# EAGLE design UPS-MAF-APU (EAGLE 9.3.0)
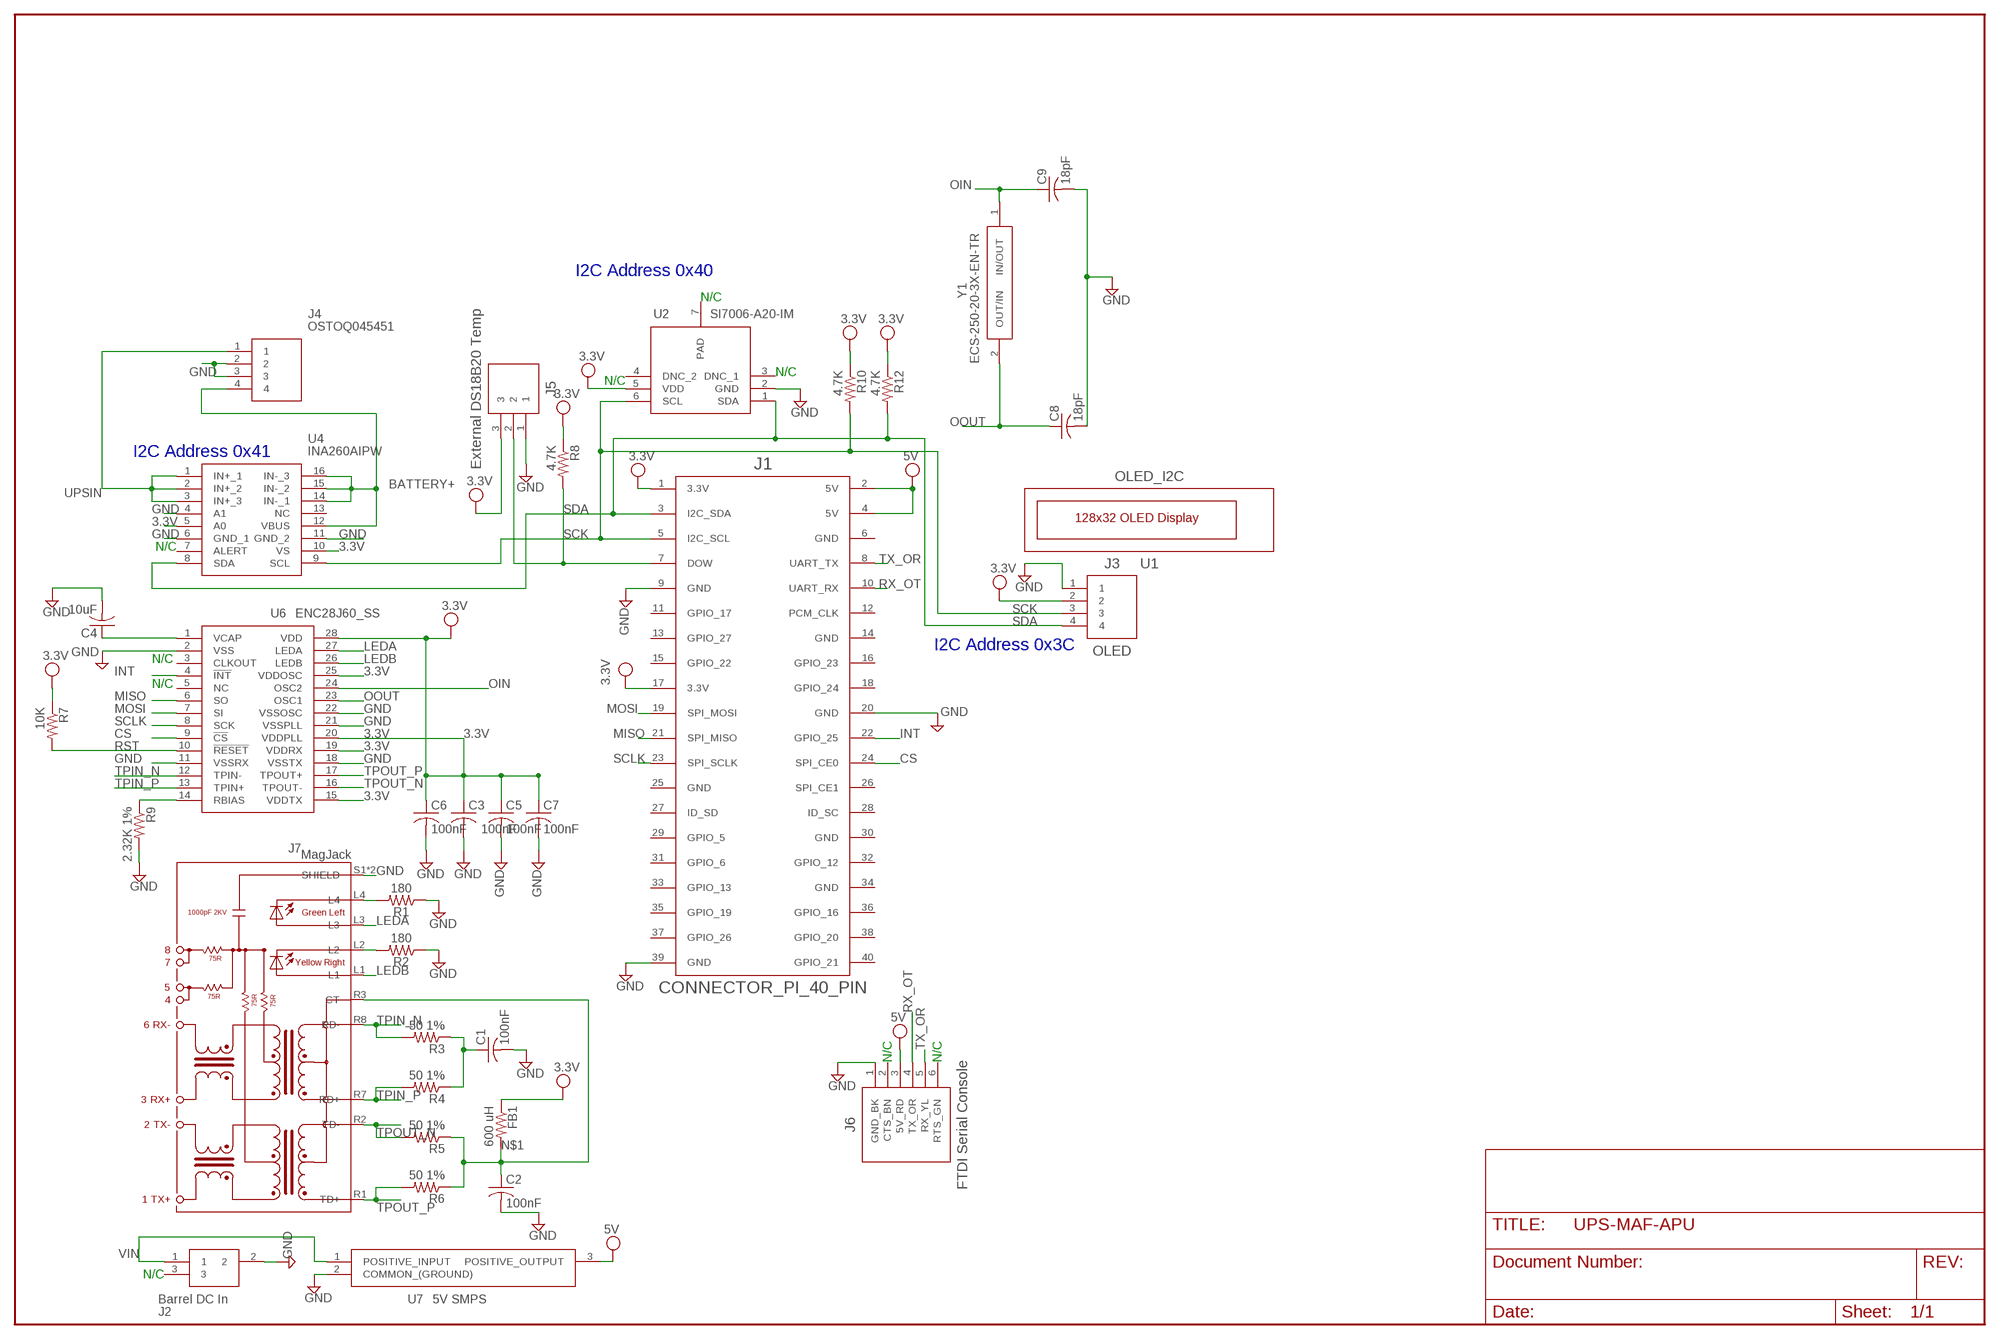
[diagram p0: schematic, sheet 1]

## Parts
C1  100nF  C-USC0603  [C0603]
C2  100nF  C-USC0603  [C0603]
C3  100nF  C-USC0603  [C0603]
C4  10uF  C-USC0805  [C0805]
C5  100nF  C-USC0603  [C0603]
C6  100nF  C-USC0603  [C0603]
C7  100nF  C-USC0603  [C0603]
C8  18pF  C-USC0603  [C0603]
C9  18pF  C-USC0603  [C0603]
FB1  600 uH  R-US_R0805  [R0805]
J1  CONNECTOR_PI_40_PIN  [2X20]
J2  Barrel DC In  PJ-102AH  [PJ-102AH]
J3  OLED  CONNECTOR_4  [ESQ-104-XX-X-S]
J4  OSTOQ045451  [OSTOQ045451]
J5  External DS18B20 Temp  CONNECTOR-3  [MOLEX_70553-0002]
J6  FTDI Serial Console  CONNECTOR-6-FTDI  [ESQ-106-XX-X-S]
J7  MagJack  RB1-125BAG1A  [WIZNET_RB1-125BAG1A]
R1  180  180OHM-0603-1/10W-1%  [0603]
R2  180  180OHM-0603-1/10W-1%  [0603]
R3  50 1%  R-US_R0805  [R0805]
R4  50 1%  R-US_R0805  [R0805]
R5  50 1%  R-US_R0805  [R0805]
R6  50 1%  R-US_R0805  [R0805]
R7  10K  R-US_R0805  [R0805]
R8  4.7K  R-US_R0805  [R0805]
R9  2.32K 1%  R-US_R0805  [R0805]
R10  4.7K  R-US_R0805  [R0805]
R12  4.7K  R-US_R0805  [R0805]
U1  OLED_I2C  [OLED-I2C]
U2  SI7006-A20-IM  [SON100P300X300X80-7N]
U4  INA260AIPW  [SOP65P640X120-16N]
U6  ENC28J60_SS  [SOP65P780X200-28N]
U7  5V SMPS  OKI-78SR-5_1.5-W36H-C  [OKI-78SR-HORIZONTAL]
Y1  ECS-250-20-3X-EN-TR  [ECS250203XENTR]

## Nets
3.3V [supply]: C3.1 C5.1 C6.1 C7.1 FB1.1 J1.1(3.3V) J1.17(3.3V) J3.2 J5.3 R7.1 R8.1 R10.1 R12.1 U2.5(VDD) U4.5(A0) U4.10(VS) U6.15(VDDTX) U6.19(VDDRX) U6.20(VDDPLL) U6.25(VDDOSC) U6.28(VDD)
5V: J1.2(5V) J1.4(5V) J6.3(5V_RD) U7.3(POSITIVE_OUTPUT)
BATTERY+ [POWER]: J4.4 U4.12(VBUS) U4.14(IN-_1) U4.15(IN-_2) U4.16(IN-_3)
CS: J1.24(SPI_CE0) U6.9(!CS)
GND: C1.2 C2.2 C3.2 C4.2 C5.2 C6.2 C7.2 C8.2 C9.2 J1.9(GND) J1.20(GND) J1.39(GND) J2.2 J3.1 J4.2 J4.3 J5.1 J6.1(GND_BK) J7.S1(SHIELD) J7.S2(SHIELD) R1.1 R2.1 R9.2 U2.2(GND) U4.4(A1) U4.6(GND_1) U4.11(GND_2) U6.2(VSS) U6.11(VSSRX) U6.18(VSSTX) U6.21(VSSPLL) U6.22(VSSOSC) U7.2(COMMON_(GROUND))
INT: J1.22(GPIO_25) U6.4(!INT)
LEDA: J7.L3 U6.27(LEDA)
LEDB: J7.L1 U6.26(LEDB)
MISO: J1.21(SPI_MISO) U6.6(SO)
MOSI: J1.19(SPI_MOSI) U6.7(SI)
N$1: C2.1 FB1.2 J7.R3(CT) R5.1 R6.1
N$3: C4.1 U6.1(VCAP)
N$4: J1.7(DOW) J5.2 R8.2
N$5: J7.L2 R2.2
N$6: C1.1 R3.1 R4.1
N$7: J7.L4 R1.2
N$9: R9.1 U6.14(RBIAS)
OIN: C9.1 U6.24(OSC2) Y1.1(IN/OUT)
OOUT: C8.1 U6.23(OSC1) Y1.2(OUT/IN)
RST: R7.2 U6.10(!RESET)
RX_OT: J1.10(UART_RX) J6.4(TX_OR)
SCK: J1.5(I2C_SCL) J3.3 R10.2 U2.6(SCL) U4.9(SCL)
SCLK: J1.23(SPI_SCLK) U6.8(SCK)
SDA: J1.3(I2C_SDA) J3.4 R12.2 U2.1(SDA) U4.8(SDA)
TPIN_N [diffp1]: J7.R8(RD-) R3.2 U6.12(TPIN-)
TPIN_P [diffp1]: J7.R7(RD+) R4.2 U6.13(TPIN+)
TPOUT_N [diff pair 2]: J7.R2(TD-) R5.2 U6.16(TPOUT-)
TPOUT_P [diff pair 2]: J7.R1(TD+) R6.2 U6.17(TPOUT+)
TX_OR: J1.8(UART_TX) J6.5(RX_YL)
UPSIN [POWER]: J4.1 U4.1(IN+_1) U4.2(IN+_2) U4.3(IN+_3)
VIN: J2.1 U7.1(POSITIVE_INPUT)
Unconnected: J1.6(GND) J1.11(GPIO_17) J1.12(PCM_CLK) J1.13(GPIO_27) J1.14(GND) J1.15(GPIO_22) J1.16(GPIO_23) J1.18(GPIO_24) J1.25(GND) J1.26(SPI_CE1) J1.27(ID_SD) J1.28(ID_SC) J1.29(GPIO_5) J1.30(GND) J1.31(GPIO_6) J1.32(GPIO_12) J1.33(GPIO_13) J1.34(GND) J1.35(GPIO_19) J1.36(GPIO_16) J1.37(GPIO_26) J1.38(GPIO_20) J1.40(GPIO_21) J2.3 J6.2(CTS_BN) J6.6(RTS_GN) U2.3(DNC_1) U2.4(DNC_2) U4.7(ALERT) U4.13(NC) U6.3(CLKOUT) U6.5(NC)

## Notes on the sheet
- I2C Address 0x40
- N/C
- N/C | N/C
- I2C Address 0x41
- N/C
- I2C Address 0x3C
- N/C
- N/C
- N/C | N/C
- N/C

## Power pins joined to a net without a drawn wire
PAD: U2.7(PAD)

## Library data of the parts
C1-C9 = resistor:C-US: CAPACITOR, American symbol
FB1 R4-R7 R9 = adafruit:R-US_: RESISTOR, American symbol
J1 = APU_ENGR480_UPS_EAGLE_Library:CONNECTOR_PI_40_PIN
J2 = APU_ENGR480_UPS_EAGLE_Library:PJ-102AH: DC POWER JACK Source: Datasheet <http://www.cui.com/product/resource/digikeypdf/pj-102ah.pdf>; DESCRIPTION: DC POWER JACK; HEIGHT: mm; MANUFACTURER_NAME: CUI; MANUFACTURER_PART_NUMBER: PJ-102AH; MOUSER_PART_NUMBER: 490-PJ-102AH; MOUSER_PRICE-STOCK: https://www.mouser.com/Search/Refine.aspx?Keyword=490-PJ-102AH
J3 = APU_ENGR480_UPS_EAGLE_Library:CONNECTOR_4
J4 = APU_ENGR480_UPS_EAGLE_Library:OSTOQ045451: 5.08mm series Close right-angle 4pin Source: Datasheet <http://www.on-shore.com/wp-content/uploads/2015/09/ostoqxx5451.pdf>; DESCRIPTION: 5.08mm series Close right-angle 4pin; HEIGHT: 8.5mm; MANUFACTURER_NAME: On-Shore Technology, Inc; MANUFACTURER_PART_NUMBER: OSTOQ045451
J5 = APU_ENGR480_UPS_EAGLE_Library:CONNECTOR-3
J6 = APU_ENGR480_UPS_EAGLE_Library:CONNECTOR-6-FTDI
J7 = APU_ENGR480_UPS_EAGLE_Library:RB1-125BAG1A: Accessory RJ-45 With Transformer Connector - UDE From SnapEDA; AVAILABILITY: Good; DESCRIPTION: Accessory RJ-45 With Transformer Connector - UDE; MF: WIZnet; MP: RB1-125BAG1A; PACKAGE: None; PRICE: 2.18 USD
R1 R2 = SparkFun-Resistors:180OHM: 180Ω resistor A resistor is a passive two-terminal electrical component that implements electrical resistance as a circuit element. Resistors act to reduce current flow, and, at the same time, act to lower voltage levels within circuits. - Wikipedia; PROD_ID: RES-08788
R3 R8 R10 R12 = adafruit:R-US_: RESISTOR, American symbol; CRCW060350R0FKEA: 50
U1 = APU_ENGR480_UPS_EAGLE_Library:OLED_I2C
U2 = APU_ENGR480_UPS_EAGLE_Library:SI7006-A20-IM: Silicon Labs Si7006-A20-IM Temperature & Humidity Sensor 6-Pin DFN, -40 +125 C Source: Datasheet <https://componentsearchengine.com/Datasheets/2/SI7006-A20-IM.pdf>; DESCRIPTION: Silicon Labs Si7006-A20-IM Temperature & Humidity Sensor 6-Pin DFN, -40 +125 C; HEIGHT: 0.8mm; MANUFACTURER_NAME: Silicon Labs; MANUFACTURER_PART_NUMBER: Si7006-A20-IM; MOUSER_PART_NUMBER: 634-SI7006-A20-IM; MOUSER_PRICE-STOCK: https://www.mouser.com/Search/Refine.aspx?Keyword=634-SI7006-A20-IM; RS_PART_NUMBER: 8652274P; RS_PRICE-STOCK: http://uk.rs-online.com/web/p/products/8652274P
U4 = APU_ENGR480_UPS_EAGLE_Library:INA260AIPW: 36V, Bi-Dir, High Accuracy, Low-/High-Side, I2C Current/Pwr Monitor w/Integrated 2m Shunt Resistor Source: Datasheet <http://www.ti.com/lit/gpn/ina260>; DESCRIPTION: 36V, Bi-Dir, High Accuracy, Low-/High-Side, I2C Current/Pwr Monitor w/Integrated 2m Shunt Resistor; HEIGHT: 1.2mm; MANUFACTURER_NAME: Texas Instruments; MANUFACTURER_PART_NUMBER: INA260AIPW; MOUSER_PART_NUMBER: 595-INA260AIPW; MOUSER_PRICE-STOCK: https://www.mouser.com/Search/Refine.aspx?Keyword=595-INA260AIPW
U6 = APU_ENGR480_UPS_EAGLE_Library:ENC28J60_SS: Ethernet ICs 8 KB RAM MAC&PHY Ethernet Controller Source: Datasheet <http://docs-emea.rs-online.com/webdocs/0cee/0900766b80ceeb3f.pdf>; ALLIED_NUMBER: 70046819; ALLIED_PRICE-STOCK: http://www.alliedelec.com/microchip-technology-inc-enc28j60-ss/70046819/; DESCRIPTION: Ethernet ICs 8 KB RAM MAC&PHY Ethernet Controller; HEIGHT: 2mm; MANUFACTURER_NAME: Microchip; MANUFACTURER_PART_NUMBER: ENC28J60/SS; MOUSER_PART_NUMBER: 579-ENC28J60/SS; MOUSER_PRICE-STOCK: https://www.mouser.com/Search/Refine.aspx?Keyword=579-ENC28J60%2FSS; RS_PART_NUMBER: 6665713P; RS_PRICE-STOCK: http://uk.rs-online.com/web/p/products/6665713P
U7 = APU_ENGR480_UPS_EAGLE_Library:OKI-78SR-5_1.5-W36H-C: Switching Regulator 7-36Vin 5Vo 1.5A Non-Isolated DC-DC Converter, 5V dc Output, 1.5A Source: Datasheet <http://www.mouser.com/ds/2/281/oki-78sr-56393.pdf>; DESCRIPTION: Switching Regulator 7-36Vin 5Vo 1.5A Non-Isolated DC-DC Converter, 5V dc Output, 1.5A; HEIGHT: mm; MANUFACTURER_NAME: Murata Electronics; MANUFACTURER_PART_NUMBER: OKI-78SR-5/1.5-W36H-C; MOUSER_PART_NUMBER: 580-OKI78SR51.5W36HC; MOUSER_PRICE-STOCK: https://www.mouser.com/Search/Refine.aspx?Keyword=580-OKI78SR51.5W36HC; RS_PART_NUMBER: 1736931; RS_PRICE-STOCK: http://uk.rs-online.com/web/p/products/1736931
Y1 = APU_ENGR480_UPS_EAGLE_Library:ECS-250-20-3X-EN-TR: CRYSTAL 25.0000MHZ 20PF SMD Source: Datasheet <http://www.ecsxtal.com/store/pdf/CSM-3X.pdf>; DESCRIPTION: CRYSTAL 25.0000MHZ 20PF SMD; HEIGHT: 2.3mm; MANUFACTURER_NAME: ECS Inc.; MANUFACTURER_PART_NUMBER: ECS-250-20-3X-EN-TR

## Net classes
1 POWER: width 2.54 mm, drill 0.508 mm
2 diffp1: width 0.203 mm, clearance 0.254 mm
3 diff pair 2: width 0.203 mm, clearance 0.254 mm
4 supply: width 0.33 mm

## Board
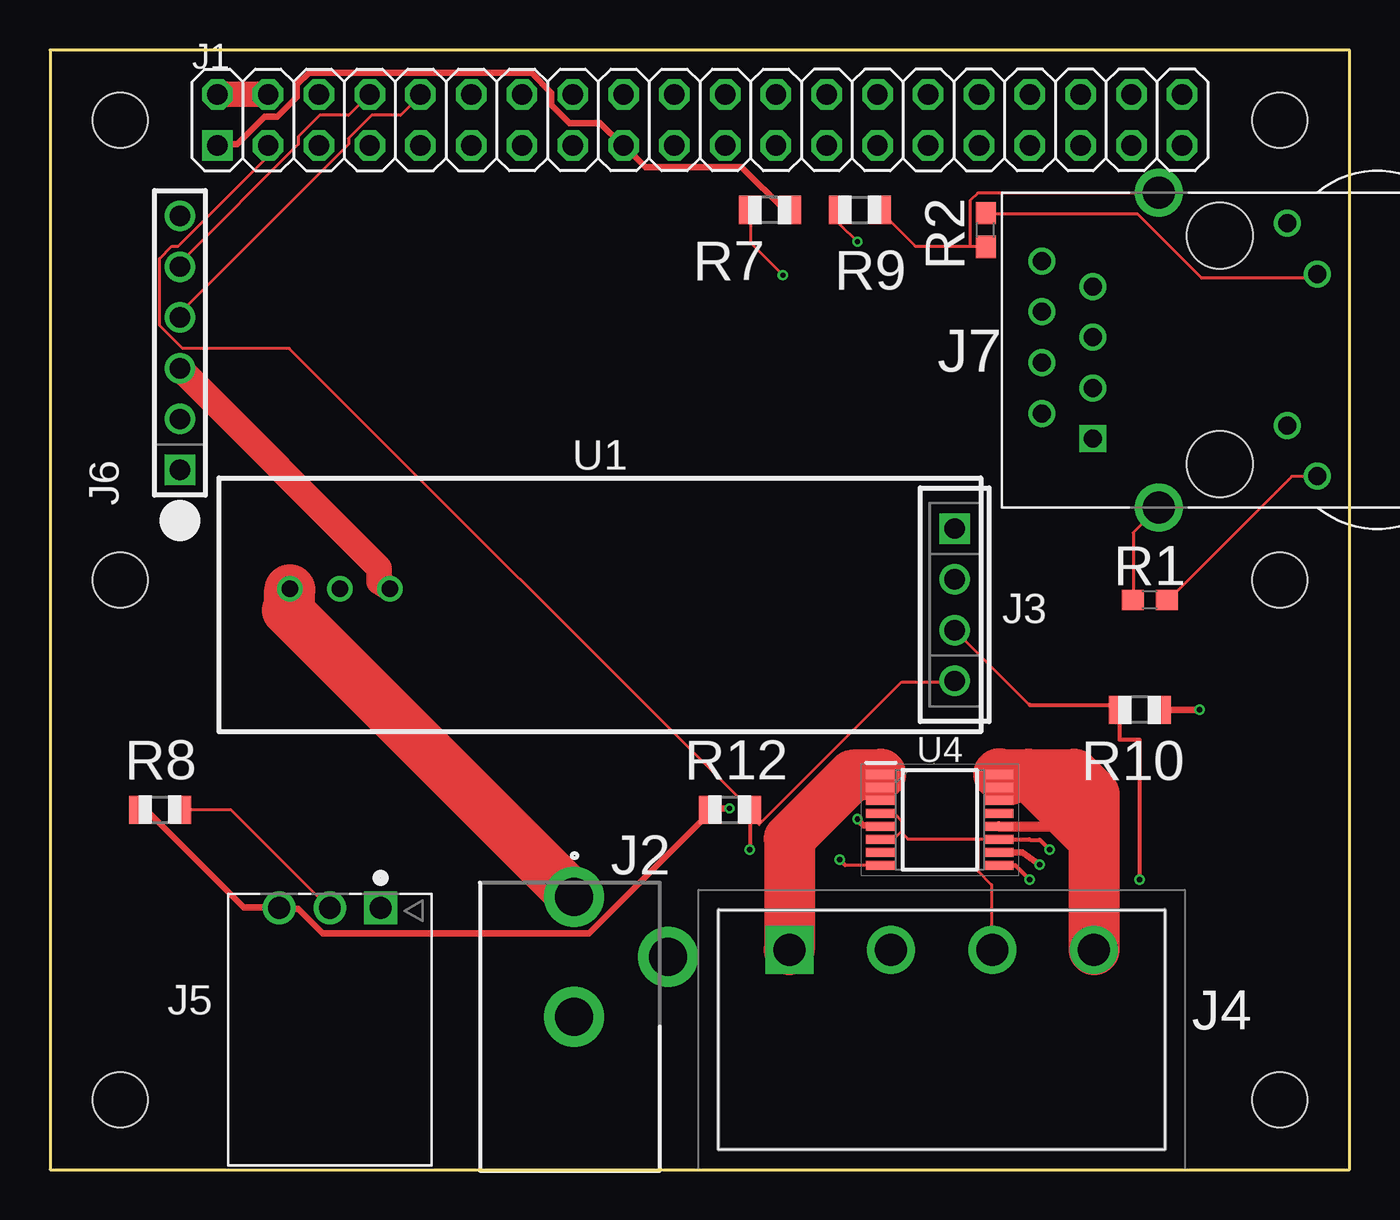
[diagram p1: board, top side]
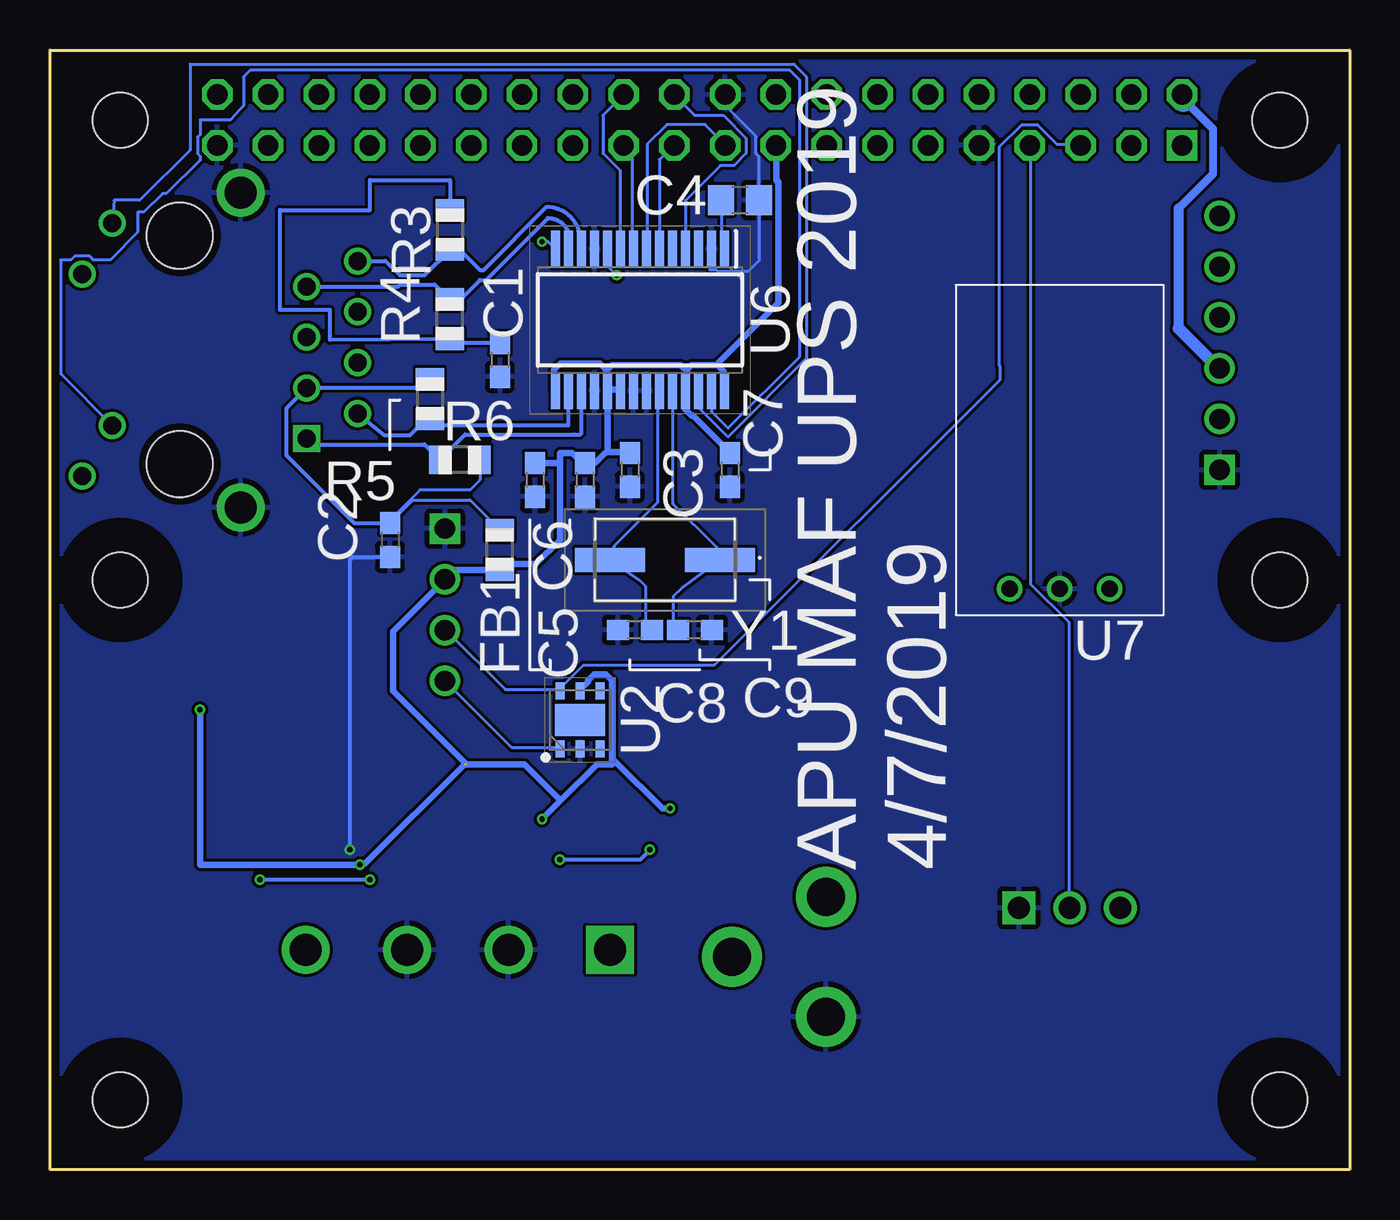
[diagram p2: board, bottom side, seen from below]

Size 65 x 56 mm. Coordinates in mm from the lower left corner, seen from the top.
Outline: 0,0 65,0 65,56 0,56 0,0
Copper layers (1*16): Top 0.035559375mm / dielectric 1.6mm / Bottom 0.035559375mm
Design rules "oshpark-2layer *": minimum track width 6mil, minimum drill 10mil, track to track 6mil, track to pad 6mil, pad to pad 6mil, via to via 6mil, smd to smd 6mil, copper to edge 15mil, drill to drill 6mil, minimum pad ring 5mil, minimum via ring 5mil, stop-mask expansion 2.5mil, vias tented up to drill 20mil, thermal gap 10mil
Holes 2.75 mm at 3.5,3.5 61.5,3.5 61.5,52.5 3.5,52.5 3.5,29.5 61.5,29.5
tKeepout: area 0.4,49.4 to 6.6,55.6; area 0.4,26.4 to 6.6,32.6; area 58.4,49.4 to 64.6,55.6; area 58.4,26.4 to 64.6,32.6; area 58.4,0.4 to 64.6,6.6; area 0.4,0.4 to 6.6,6.6
bKeepout: area 0.4,0.4 to 6.6,6.6; area 58.4,49.4 to 64.6,55.6; area 58.4,0.4 to 64.6,6.6; area 0.4,26.4 to 6.6,32.6; area 58.4,26.4 to 64.6,32.6; area 0.4,49.4 to 6.6,55.6
tRestrict: area 0.4,0.4 to 6.6,6.6; area 0.4,49.4 to 6.6,55.6; area 58.4,49.4 to 64.6,55.6; area 58.4,0.4 to 64.6,6.6; area 58.4,26.4 to 64.6,32.6; area 0.4,26.4 to 6.6,32.6
bRestrict: area 0.4,49.4 to 6.6,55.6; area 0.4,26.4 to 6.6,32.6; area 58.4,49.4 to 64.6,55.6; area 58.4,26.4 to 64.6,32.6; area 0.4,0.4 to 6.6,6.6; area 58.4,0.4 to 64.6,6.6

### Footprints (pad centres in the part's own frame; a part is rotated, then mirrored left to right if it is on the bottom)
C0603 = smd 1.1 x 1: 1 -0.85,0; 2 0.85,0
C0805 = smd 1.3 x 1.5: 1 -0.95,0; 2 0.95,0
R0805 = smd 1.1 x 1.4: 1 -1,0; 2 1,0
2X20 = drill 1.016 square: 1 -24.13,-1.27 | drill 1.016 octagon: 2 -24.13,1.27; 3 -21.59,-1.27; 4 -21.59,1.27; 5 -19.05,-1.27; 6 -19.05,1.27; 7 -16.51,-1.27; 8 -16.51,1.27; 9 -13.97,-1.27; 10 -13.97,1.27; 11 -11.43,-1.27; 12 -11.43,1.27; 13 -8.89,-1.27; 14 -8.89,1.27; 15 -6.35,-1.27; 16 -6.35,1.27; 17 -3.81,-1.27; 18 -3.81,1.27; 19 -1.27,-1.27; 20 -1.27,1.27; 21 1.27,-1.27; 22 1.27,1.27; 23 3.81,-1.27; 24 3.81,1.27; 25 6.35,-1.27; 26 6.35,1.27; 27 8.89,-1.27; 28 8.89,1.27; 29 11.43,-1.27; 30 11.43,1.27; 31 13.97,-1.27; 32 13.97,1.27; 33 16.51,-1.27; 34 16.51,1.27; 35 19.05,-1.27; 36 19.05,1.27; 37 21.59,-1.27; 38 21.59,1.27; 39 24.13,-1.27; 40 24.13,1.27
PJ-102AH = drill 1.9 pad 3: 1 4.3,-3; 2 4.3,3; 3 -0.4,0
ESQ-104-XX-X-S = drill 1.016 pad 1.524 square: 1 -3.81,0 | drill 1.016 pad 1.524: 2 -1.27,0; 3 1.27,0; 4 3.81,0
OSTOQ045451 = drill 1.6 pad 2.4 square: 1 0,0 | drill 1.6 pad 2.4: 2 5.08,0; 3 10.16,0; 4 15.24,0
MOLEX_70553-0002 = drill 1.09 pad 1.64 square: 1 2.54,6.095 | drill 1.09 pad 1.64: 2 0,6.095; 3 -2.54,6.095
ESQ-106-XX-X-S = drill 1.016 pad 1.524 square: 1 0,0 | drill 1.016 pad 1.524: 2 2.54,0; 3 5.08,0; 4 7.62,0; 5 10.16,0; 6 12.7,0
WIZNET_RB1-125BAG1A = drill 0.9: L1 6.325,-3.38; L2 3.784,-4.899; L3 -3.786,-3.379; L4 -6.325,-4.9 | drill 0.9 pad 1.3 square: R1 -4.446,6.349 | drill 0.9 pad 1.3: R2 -3.176,8.889; R3 -1.906,6.349; R4 -0.636,8.889; R5 0.634,6.349; R6 1.904,8.889; R7 3.174,6.349; R8 4.444,8.889 | drill 1.6 pad 2.184: S1 -7.876,3.049; S2 7.874,3.049 | hole 3.3: 5.714,-0.001; -5.716,-0.001
0603 = smd 1.1 x 1: 1 -0.85,0; 2 0.85,0
SON100P300X300X80-7N = smd 0.85 x 0.45: 1 -1.45,1; 2 -1.45,0; 3 -1.45,-1; 4 1.45,-1; 5 1.45,0; 6 1.45,1 | smd 1.6 x 2.5: 7 0,0
SOP65P640X120-16N = smd 1.475 x 0.45: 1 -2.938,2.275; 2 -2.938,1.625; 3 -2.938,0.975; 4 -2.938,0.325; 5 -2.938,-0.325; 6 -2.938,-0.975; 7 -2.938,-1.625; 8 -2.938,-2.275; 9 2.938,-2.275; 10 2.938,-1.625; 11 2.938,-0.975; 12 2.938,-0.325; 13 2.938,0.325; 14 2.938,0.975; 15 2.938,1.625; 16 2.938,2.275
SOP65P780X200-28N = smd 1.8 x 0.45: 1 -3.55,4.225; 2 -3.55,3.575; 3 -3.55,2.925; 4 -3.55,2.275; 5 -3.55,1.625; 6 -3.55,0.975; 7 -3.55,0.325; 8 -3.55,-0.325; 9 -3.55,-0.975; 10 -3.55,-1.625; 11 -3.55,-2.275; 12 -3.55,-2.925; 13 -3.55,-3.575; 14 -3.55,-4.225; 15 3.55,-4.225; 16 3.55,-3.575; 17 3.55,-2.925; 18 3.55,-2.275; 19 3.55,-1.625; 20 3.55,-0.975; 21 3.55,-0.325; 22 3.55,0.325; 23 3.55,0.975; 24 3.55,1.625; 25 3.55,2.275; 26 3.55,2.925; 27 3.55,3.575; 28 3.55,4.225
OKI-78SR-HORIZONTAL = drill 0.835 pad 1.252: 1 2.5,-6.95; 2 0,-6.95; 3 -2.5,-6.95
ECS250203XENTR = smd 3.5 x 1.2: 1 -2.75,0; 2 2.75,0

### Placement (x,y rotation side)
C1  42.5,40.5 270 bottom
C2  48,31.5 270 bottom
C3  36,35 270 bottom
C4  30.5,48.5 0 bottom
C5  40.75,34.5 270 bottom
C6  38.25,34.5 270 bottom
C7  31,35 270 bottom
C8  35.75,27 180 bottom
C9  32.75,27 0 bottom
FB1  42.5,31 90 bottom
J1  32.5,52.5 0 top
J2  30.5,10.65 180 top
J3  45.25,28.25 270 top
J4  36.98,11 0 top
J5  14,7 0 top
J6  6.5,35 90 top
J7  58.5,41 90 top
R1  55,28.5 0 top
R2  46.8,47 90 top
R3  45,47 270 bottom
R4  45,42.55 90 bottom
R5  46,38.55 270 bottom
R6  44.5,35.5 180 bottom
R7  36,48 180 top
R8  5.5,18 0 top
R9  40.5,48 0 top
R10  54.5,23 180 top
R12  34,18 0 top
U1  27.5,28.25 180 top
U2  38.5,22.5 90 bottom
U4  44.5,17.5 0 top
U6  35.5,42.5 270 bottom
U7  14.5,36 0 bottom
Y1  34.25,30.5 180 bottom

### Tracks (layer width: path | path; a pad name or v marks a point on that pad's centre or on a via)
3.3V  (via drill 0.25)  (2 unrouted)
  Top 0.33: R7.1 36.96,48.01 36.73,48.01 34.59,50.14 29.79,50.14 28.73,51.21 J1.17 28.57,51.28 27.51,52.35 25.98,52.35 25.07,53.26 25.07,53.87 24.08,54.86 12.95,54.86 12.34,54.25 12.34,53.65 11.35,52.65 10.74,52.65 9.37,51.28 8.38,51.28 J1.1 | R8.1 4.57,17.98 4.8,17.98 9.68,13.11 11.43,13.11 J5.3 11.58,13.03 12.42,13.03 13.64,11.81 26.98,11.81 33.07,17.91 R12.1 33.07,18.06 v33.98,18.06 | v40.39,17.53 40.69,17.22 41.53,17.22 U4.5 | U4.10 48.62,15.88 v49.5,15.25 | R10.1 v57.5,23
  Bottom 0.33: C7.1 31.01,35.89 32.84,37.72 32.92,37.72 33.22,38.02 33.22,38.94 U6.25 33.15,39.09 33.15,40.01 | 31.62,40.23 31.32,39.93 31.32,39.01 U6.28 | 31.62,40.23 32.92,40.23 33.15,40.01 | 37.11,35.89 36.08,35.89 C3.1 | U6.20 36.5,39.01 37.11,39.01 U6.19 | 37.19,40.01 37.49,40.31 39.47,40.31 39.78,40.01 39.78,39.01 U6.15 | 37.19,40.01 37.19,39.17 U6.19 | 37.11,35.89 37.11,38.79 U6.19 | 33.15,40.01 33.3,40.08 33.45,40.23 36.88,40.23 37.03,40.08 37.19,40.01 | 36.88,20.5 36.88,24.46 37.19,24.77 37.8,24.77 38.1,24.46 38.1,24.38 38.48,24 U2.5 | 36.88,20.5 36.89,20.49 36.89,20.27 37.64,20.27 39.46,18.46 | 44.17,20.27 47.83,23.93 47.83,26.92 45.26,29.49 J3.2 45.11,29.57 44.68,30 FB1.1 | v33.98,18.06 34.37,18.06 36.73,20.42 36.88,20.5 | 39.46,18.46 v40.39,17.53 | 42.44,30.13 FB1.1 | 28.65,51.21 J1.17 28.65,51.05 28.65,49.45 28.57,49.38 28.57,43.36 31.55,40.39 31.62,40.23 | v57.5,23 57.5,15.25 v49.5,15.25 49.38,15.32 49.23,15.32 44.27,20.27 41.27,20.27 39.46,18.46 | 37.11,35.89 37.26,35.81 37.72,35.36 38.18,35.36 C6.1 38.41,35.36 38.9,35.85 39.5,35.85 39.5,35.35 | 41,35.31 C5.1 39.5,35.35 | 39.5,35.35 39.5,31.5 40.73,30.27 42.23,30.27 FB1.1
5V
  Top 0.152: 8.38,53.8 J1.2 | 10.9,53.8 J1.4 | 6.55,40.01 J6.3
  Top 1.27: 10.9,53.8 8.38,53.8 | 6.55,40.01 16.46,30.1 16.46,29.38 U7.3
  Bottom 0.152: 8.31,53.72 J1.2 | 6.55,40.08 J6.3
  Bottom 0.406: 8.31,53.53 6.82,52.05 6.82,49.81 8.54,48.08
  Bottom 0.508: 8.54,42.07 8.54,48.08
  Bottom 0.61: 6.55,40.08 8.54,42.07
  Bottom 1.27: 8.31,53.53 8.31,53.72
BATTERY+
  Top 0.508: U4.12 50.5,17.18 51.1,17.77 51.23,17.77 | U4.14 U4.15 U4.16
  Top 2.54: 52.22,16.5 52.22,18.78 51.23,19.77 | 52.22,16.5 J4.4 | U4.16 47.47,19.81 48,19.5 | U4.16 51.23,19.77 | 51.23,19.77 51.23,17.77 51.5,17.5 | U4.16 48.95,19.77 52.22,16.5
CS
  Bottom 0.152: U6.9 36.5,46.1 36.5,49.99 37.34,50.83 37.34,52.73 36.35,53.72 J1.24
GND  (via drill 0.25)
  Top 0.152: 46.02,46.18 43.28,46.18 41.53,47.93 R9.2 | 46.02,46.18 46.79,46.18 R2.1 | R1.1 54.18,28.57 54.18,31.85 55.4,33.07 J7.S1 | 42.56,16.88 42.6,16.92 42.6,17.45 42.29,17.75 41.6,17.75 U4.4 | 42.56,16.88 42.22,16.54 41.6,16.54 U4.6 | 46.41,16.54 42.9,16.54 42.56,16.88 | 46.41,16.54 47.4,16.54 U4.11 | 46.41,16.54 46.41,14.94 47.09,14.25 47.09,11.05 J4.3 | 46.02,46.18 46.02,48.46 46.41,48.84 55.4,48.84 J7.S2
  Top 0.203: U4.11 48.98,16.52 49,16.5 49.5,16.5 v50,16
  Bottom 0.152: U6.18 37.8,39.01 U6.18 | U6.2 31.93,45.08 32,45 31.67,45 31.59,44.92 30.08,44.92 29.55,45.45 C4.2 29.55,50.69 29.68,50.82 29.68,51.68 31.23,53.23 J1.20 | 35.81,38.96 35.81,38.94 U6.21
  Bottom 0.203: v50,16 50,30.5 49.85,30.65 C2.2
  pour Bottom (isolate 16): 65,56 65,0 0,0 0,56
  pour Bottom: 0,56 65,56 65,0 0,0
INT
  Bottom 0.152: U6.4 33.22,46.1 33.22,48.46 31.47,50.22 30.79,50.22 30.18,50.83 30.18,51.59 31.32,52.73 32.77,52.73 33.76,53.72 J1.22
LEDA
  Bottom 0.152: U6.27 31.93,37.92 31.08,37.08 27.5,40.66 27.5,54.5 27.98,54.98 55,54.98 55.32,54.66 55.32,53.21 55.5,53.03 56,52.5 57.5,52.5 57.5,51.76 57.62,51.64 57.62,50.82 57.5,50.7 57.5,50.5 59.18,48.82 59.37,48.82 60.3,47.89 60.61,47.89 60.61,46.89 62,45.5 62.84,45.5 63.02,45.69 63.77,45.69 63.96,45.5 64.47,45.5 64.47,39.8 J7.L3
LEDB
  Bottom 0.152: U6.26 32.54,38.94 32.54,38.1 31.09,36.65 27.15,40.58 27.15,54.65 27.79,55.29 58,55.29 58,51 60.52,48.48 61.8,48.48 J7.L1
MISO
  Bottom 0.152: U6.6 34.52,46.1 34.52,50.52 33.83,51.21 J1.21
MOSI
  Bottom 0.152: U6.7 35.13,46.1 35.13,51.28 34.14,52.27 32.23,52.27 31.24,51.28 J1.19
N$1
  Bottom 0.152: R6.1 43.5,34.5 44,34 46.5,34 48,32.5 C2.1 46.85,33.5 44,33.5 FB1.2
  Bottom 0.203: R5.1 46.41,39.09 J7.R3 53.18,38.06 53.18,35.73 49.8,32.35 C2.1
N$3
  Bottom 0.152: 31.24,46.1 U6.1 31.24,46.18 31.39,46.33 31.39,48.46 C4.1
N$4
  Top 0.152: R8.2 6.55,17.98 9.07,17.98 13.95,13.11 J5.2
  Bottom 0.152: J1.7 15.93,51.21 15.93,29.26 14.02,27.36 14.02,13.11 J5.2
N$5
  Top 0.152: R2.2 46.86,47.78 54.41,47.78 57.61,44.58 63.25,44.58 63.4,44.73 J7.L2
N$6
  Bottom 0.203: C1.1 44.85,41.35 R4.1 51,41.5 51,43 53.5,43 53.5,48 49,48 49,49.5 45,49.5 R3.1
N$7
  Top 0.152: R1.2 55.85,28.57 56.01,28.57 62.1,34.67 J7.L4
N$9  (via drill 0.25)
  Top 0.152: v40.39,46.41 39.55,47.24 39.55,47.93 R9.1
  Bottom 0.152: v40.39,46.41 40.08,46.41 39.78,46.1 U6.14
OIN
  Bottom 0.152: C9.1 33.83,27.23 33.83,28.65 33.4,29.08 Y1.1 31.69,31.15 33.83,33.3 33.83,38.94 U6.24
OOUT
  Bottom 0.152: C8.1 35.2,27.01 35.2,29.18 35.48,29.46 Y1.2 36.79,31.18 34.59,33.38 34.59,38.94 U6.23
RST  (via drill 0.25)
  Top 0.152: v36.65,44.73 35.05,46.33 35.05,47.93 R7.2
  Bottom 0.152: v36.65,44.73 37.11,45.19 37.11,46.02 U6.10
RX_OT
  Top 0.152: J6.4 6.55,42.67 6.55,42.9 14.94,51.28 14.94,51.59 16.08,52.73 17.53,52.73 18.52,53.72 J1.10
SCK  (via drill 0.25)
  Top 0.152: 49,23.24 45.26,26.98 J3.3
  Top 0.203: U4.9 48.27,15.22 v49,14.5 | v54.5,14.5 54.5,21.5 53.5,21.5 R10.2 53.26,23.24 49,23.24
  Bottom 0.152: U2.6 39.55,24 42.22,24 45.19,26.98 J3.3 | J1.5 13.49,51.28 14.63,51.28 15.62,52.27 16.38,52.27 17.53,51.13 17.53,40.23 17.5,40.21 17.5,39.5 31.78,25.22 38.33,25.22 39.47,24.08 U2.6 | 39.47,24 U2.6
  Bottom 0.203: v49,14.5 v54.5,14.5
SCLK
  Bottom 0.152: U6.8 35.89,46.1 35.89,50.83 36.27,51.21 J1.23
SDA  (via drill 0.25)
  Top 0.152: 41.53,15.24 U4.8 39.77,15.22 | J1.3 10.9,51.21 10.9,50.67 6.4,46.18 6.1,46.18 5.49,45.57 5.49,42.22 6.63,41.07 11.96,41.07 34.98,18.06 R12.2 35.05,17.98 35.05,17.68 35.47,17.26 42.6,24.38 45.19,24.38 J3.4
  Top 0.203: 39.77,15.22 v39.5,15.5 | R12.2 v35,16
  Bottom 0.152: U2.1 39.55,21.11 41.91,21.11 45.19,24.38 J3.4
  Bottom 0.203: v35,16 35.5,15.5 v39.5,15.5
TPIN_N
  Bottom 0.203: J7.R8 48.22,45.44 47.5,44.73 46.27,44.73 R3.2 44.5,46 43.5,45 43.32,45 40.16,48.16 arc90 38.5,46.5 38.5,46 | 38.5,46 38.5,45.5 | U6.12 38.48,46 38.5,46
TPIN_P
  Bottom 0.203: 45.12,43.62 R4.2 | J7.R7 47.6,44.17 47.5,44.27 45.77,44.27 R4.2 | R4.2 44.5,43.5 43.5,44.5 43.18,44.5 40.09,47.59 arc90 39,46.5 39,46.02 | 39.08,46.85 U6.13 | 39,46.02 39,46 | 39,46 39,45.5 | U6.13 39.09,46.02 39,46.02 | U6.13 39.02,46 39,46
TPOUT_N
  Bottom 0.203: J7.R2 48.29,36.73 47,36.73 46.5,37.23 R5.2 45.73,37.23 39.07,37.23 39.07,38.94 U6.16
TPOUT_P
  Bottom 0.203: J7.R1 52.1,36.27 46.27,36.27 R6.2 44.23,36.77 38.77,36.77 38.76,36.76 38.5,36.76 38.42,36.83 U6.17
TX_OR
  Top 0.152: J6.5 6.55,45.19 6.55,45.41 12.42,51.28 12.42,51.66 13.49,52.73 14.94,52.73 15.93,53.72 J1.8
UPSIN
  Top 0.508: U4.1 U4.2 U4.3
  Top 2.54: U4.1 41.53,19.74 40.16,19.74 36.98,16.56 J4.1
VIN
  Top 0.152: 11.99,29 U7.1 | 26.14,13.72 J2.1
  Top 2.54: 26.14,13.72 11.87,27.98 11.99,27.98 11.99,29

### Text on the board
Top: TOP
Bottom: Bottom
bPlace: APU MAF UPS 2019 / 4/7/2019